# EAGLE design diyAutoSteer (EAGLE 7.6.0)
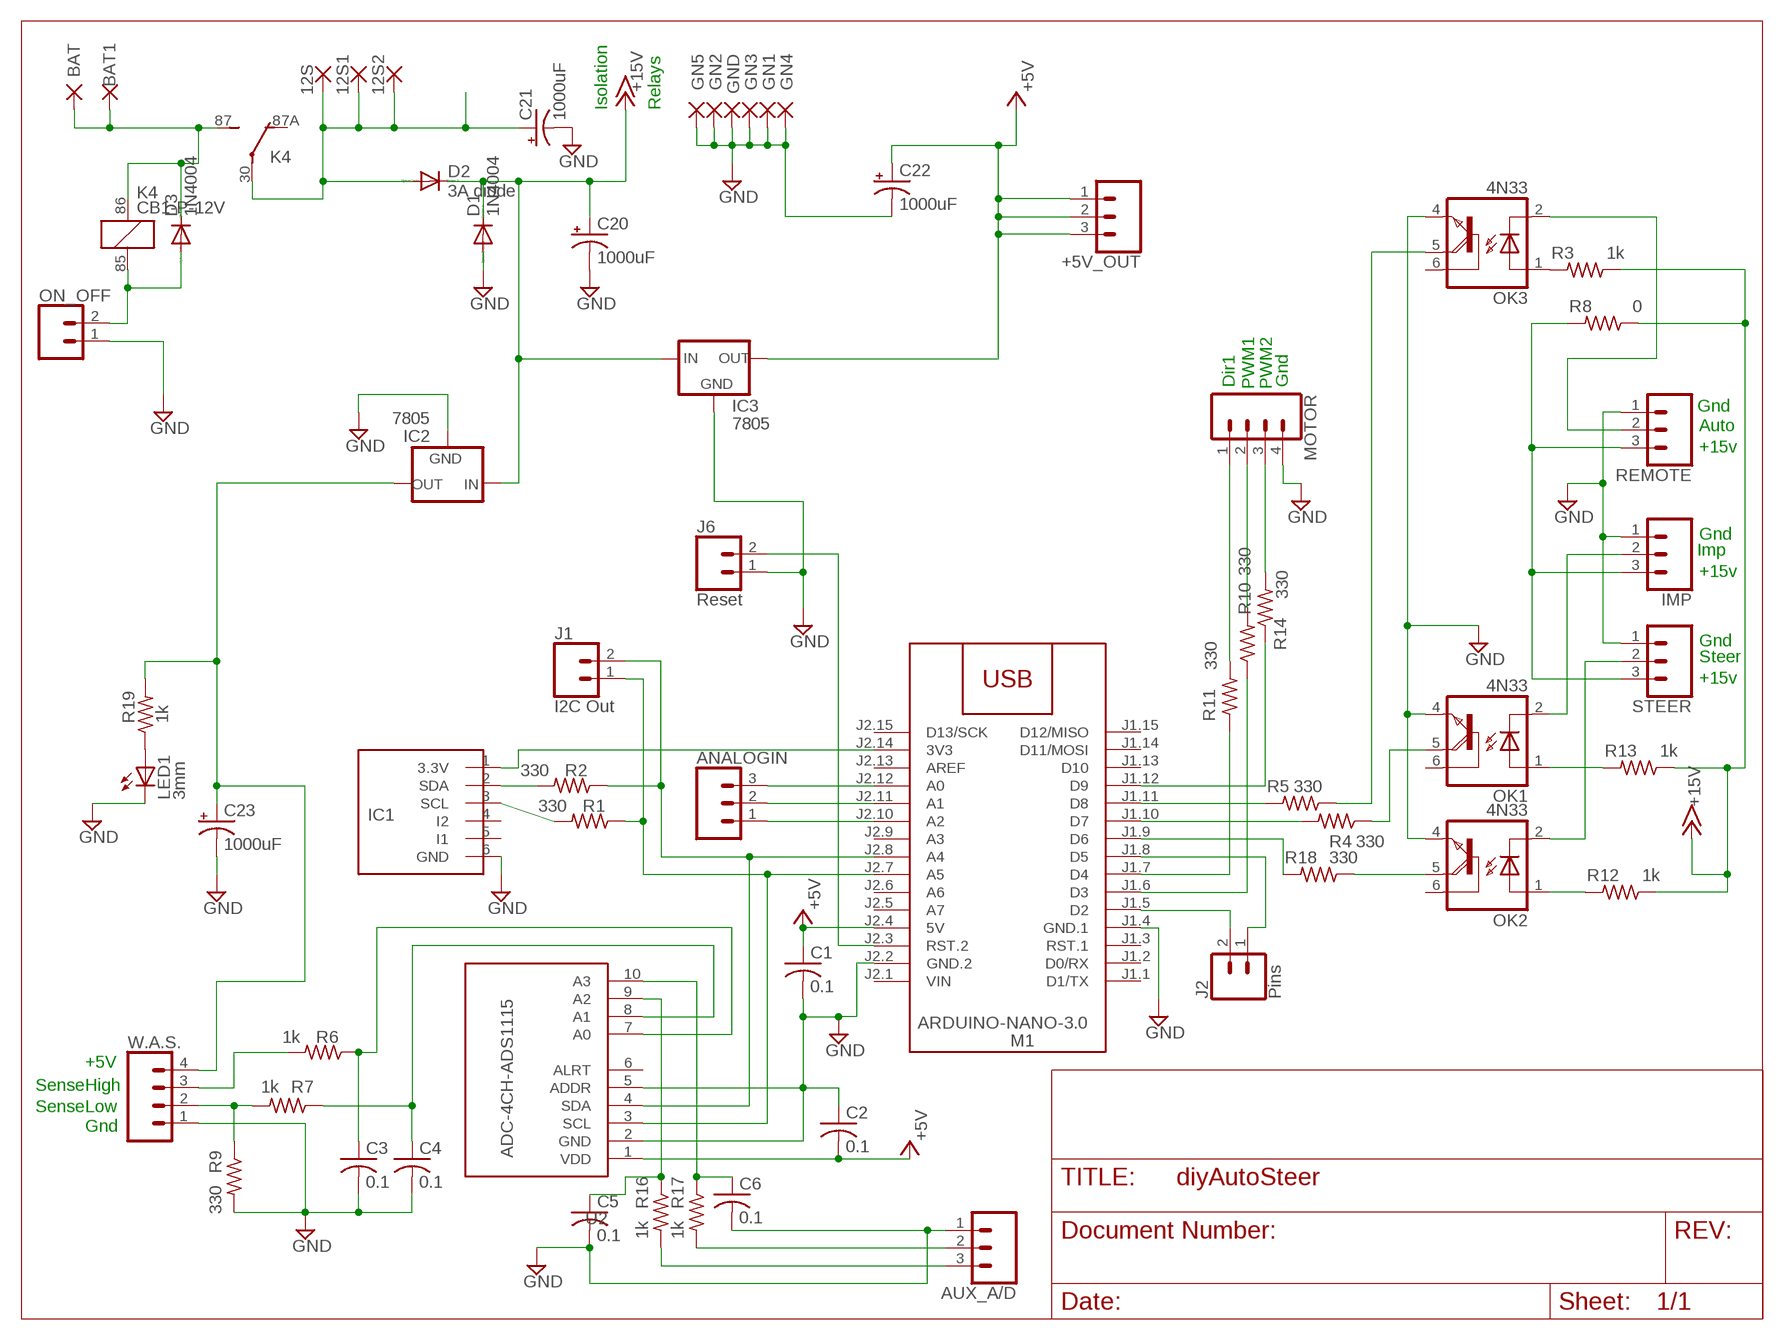
[diagram p0: schematic, sheet 1]

## Parts
12S  WIREPAD3,81/1,1  [3,81/1,1]
12S1  WIREPAD3,81/1,1  [3,81/1,1]
12S2  WIREPAD3,81/1,1  [3,81/1,1]
+5V_OUT  CONN_03LONGPADS  [1X03_LONGPADS]
ANALOGIN  CONN_03LONGPADS  [1X03_LONGPADS]
AUX_A/D  CONN_03LONGPADS  [1X03_LONGPADS]
BAT  WIREPAD3,81/1,1  [3,81/1,1]
BAT1  WIREPAD3,81/1,1  [3,81/1,1]
C1  0.1  C-US025-025X050  [C025-025X050]
C2  0.1  C-US025-025X050  [C025-025X050]
C3  0.1  C-US025-025X050  [C025-025X050]
C4  0.1  C-US025-025X050  [C025-025X050]
C5  0.1  C-US025-025X050  [C025-025X050]
C6  0.1  C-US025-025X050  [C025-025X050]
C20  1000uF  CPOL-USE5-10.5  [E5-10,5]
C21  1000uF  CPOL-USE5-10.5  [E5-10,5]
C22  1000uF  CPOL-USE5-10.5  [E5-10,5]
C23  1000uF  CPOL-USE5-10.5  [E5-10,5]
D1  1N4004  [DO41-10]
D2  3A diode  DIODE-DO27-15  [DO27-15]
D3  1N4004  [DO41-10]
GN1  WIREPAD3,81/1,1  [3,81/1,1]
GN2  WIREPAD3,81/1,1  [3,81/1,1]
GN3  WIREPAD3,81/1,1  [3,81/1,1]
GN4  WIREPAD3,81/1,1  [3,81/1,1]
GN5  WIREPAD3,81/1,1  [3,81/1,1]
GND  WIREPAD3,81/1,1  [3,81/1,1]
IC1  MMA8452Q  [BREAKOUT_6PIN]
IC2  7805  78XXS  [78XXS]
IC3  7805  78XXS  [78XXS]
IMP  CONN_03LONGPADS  [1X03_LONGPADS]
J1  I2C Out  CONN_02PTH3  [1X02_LONGPADS]
J2  Pins  CONN_02PTH3  [1X02_LONGPADS]
J6  Reset  CONN_02PTH3  [1X02_LONGPADS]
K4  CB1-P-12V  [CB1]
LED1  3mm  LED3MM  [LED3MM]
M1  ARDUINO-NANO-3.0  [ARDUINO-NANO-3.0]
MOTOR  CONN_04LONGPADS  [1X04_LONGPADS]
OK1  4N33  [DIL06]
OK2  4N33  [DIL06]
OK3  4N33  [DIL06]
ON_OFF  CONN_02PTH3  [1X02_LONGPADS]
R1  330  R-US_0309/12  [0309/12]
R2  330  R-US_0309/12  [0309/12]
R3  1k  R-US_0309/12  [0309/12]
R4  330  R-US_0309/12  [0309/12]
R5  330  R-US_0309/12  [0309/12]
R6  1k  R-US_0309/12  [0309/12]
R7  1k  R-US_0309/12  [0309/12]
R8  0  R-US_0309/12  [0309/12]
R9  330  R-US_0309/12  [0309/12]
R10  330  R-US_0309/12  [0309/12]
R11  330  R-US_0309/12  [0309/12]
R12  1k  R-US_0309/12  [0309/12]
R13  1k  R-US_0309/12  [0309/12]
R14  330  R-US_0309/12  [0309/12]
R16  1k  R-US_0309/12  [0309/12]
R17  1k  R-US_0309/12  [0309/12]
R18  330  R-US_0309/12  [0309/12]
R19  1k  R-US_0309/12  [0309/12]
REMOTE  CONN_03LONGPADS  [1X03_LONGPADS]
STEER  CONN_03LONGPADS  [1X03_LONGPADS]
U2  ADC-4CH-ADS1115  [ADC-4CH-ADS1115]
W.A.S.  CONN_04LONGPADS  [1X04_LONGPADS]

## Nets
+5V: +5V_OUT.1 +5V_OUT.2 +5V_OUT.3 C1.1 C2.2 C22.+ IC3.OUT M1.J2.4(5V) U2.1(VDD)
+15V: C20.+ D1.C D2.C IC2.IN IC3.IN R3.1 R8.1 R12.1 R13.1
BATT: BAT1.1(P) BAT.1(P) D3.C K4.86 K4.87(2:S)
GND: AUX_A/D.1 C1.2 C2.1 C3.2 C4.2 C5.2 C6.2 C20.- C21.- C22.- C23.- D1.A GN1.1(P) GN2.1(P) GN3.1(P) GN4.1(P) GN5.1(P) GND.1(P) IC1.6(GND) IC2.GND IC3.GND IMP.1 J6.1 LED1.K(C) M1.J1.4(GND.1) M1.J2.2(GND.2) MOTOR.4 OK1.4(E) OK2.4(E) OK3.4(E) ON_OFF.1 R9.2 REMOTE.1 STEER.1 U2.2(GND) U2.5(ADDR) W.A.S..1
N$1: IC1.1(3.3V) M1.J2.14(3V3)
N$2: R7.2 R9.1 W.A.S..2
N$3: IMP.3 R8.2 REMOTE.3 STEER.3
N$4: M1.J1.6(D3) R10.1
N$5: M1.J1.7(D4) R11.1
N$6: J2.2 M1.J1.5(D2)
N$7: J6.2 M1.J2.3(RST.2)
N$8: R6.2 W.A.S..3
N$10: ANALOGIN.3 M1.J2.12(A0)
N$11: M1.J1.12(D9) R14.1
N$12: IC1.2(SDA) R2.2
N$13: IC1.3(SCL) R1.2
N$14: ANALOGIN.2 M1.J2.11(A1)
N$15: ANALOGIN.1 M1.J2.10(A2)
N$16: LED1.A R19.1
N$17: MOTOR.2 R10.2
N$18: J2.1 M1.J1.8(D5)
N$19: MOTOR.1 R11.2
N$20: C3.1 R6.1 U2.7(A0)
N$21: MOTOR.3 R14.2
N$22: OK2.2(C) STEER.2
N$23: M1.J1.11(D8) R5.2
N$24: D3.A K4.85 ON_OFF.2
N$25: OK2.1(A) R12.2
N$26: OK3.1(A) R3.2
N$27: M1.J1.10(D7) R4.2
N$28: OK3.2(C) REMOTE.2
N$29: IMP.2 OK1.2(C)
N$31: M1.J1.9(D6) R18.2
N$32: OK1.1(A) R13.2
N$34: OK3.5(COL) R5.1
N$35: C6.1 R17.1 U2.10(A3)
N$36: C5.1 R16.1 U2.9(A2)
N$37: OK1.5(COL) R4.1
N$38: AUX_A/D.2 R17.2
N$39: OK2.5(COL) R18.1
N$44: C4.1 R7.1 U2.8(A1)
N$47: AUX_A/D.3 R16.2
SCL: J1.1 M1.J2.7(A5) R1.1 U2.3(SCL)
SDA: J1.2 M1.J2.8(A4) R2.1 U2.4(SDA)
SW_RAW: 12S1.1(P) 12S2.1(P) 12S.1(P) C21.+ D2.A K4.30(2:P)
V+WAS: C23.+ IC2.OUT R19.2 W.A.S..4
Unconnected: IC1.4(I2) IC1.5(I1) K4.87A(2:O) M1.J1.1(D1/TX) M1.J1.2(D0/RX) M1.J1.3(RST.1) M1.J1.13(D10) M1.J1.14(D11/MOSI) M1.J1.15(D12/MISO) M1.J2.5(A7) M1.J2.6(A6) M1.J2.9(A3) M1.J2.13(AREF) M1.J2.15(D13/SCK) OK1.6(B) OK2.6(B) OK3.6(B) U2.6(ALRT)

## Notes on the sheet
- Isolation | Relays
- Dir1 | PWM1 | PWM2 | Gnd
- Gnd
- Auto
- +15v
- Gnd
- Imp
- +15v
- Gnd
- Steer
- +15v
- +5V
- Sense | High
- Sense | Low
- Gnd

## Power pins joined to a net without a drawn wire
VIN: M1.J2.1(VIN)

## Library data of the parts
12S 12S1 12S2 BAT BAT1 GN1-GN5 GND = wirepad:WIREPAD: Wire PAD connect wire on PCB
+5V_OUT ANALOGIN AUX_A/D IMP REMOTE STEER = SparkFun-Connectors:CONN_03: Multi connection point. Often used as Generic Header-pin footprint for 0.1 inch spaced/style header connections On any of the 0.1 inch spaced packages, you can populate with these: Break Away Headers - Straight <https://www.sparkfun.com/products/116> (PRT-00116) Break Away Male Headers - Right Angle <https://www.sparkfun.com/products/553> (PRT-00553) Female Headers <https://www.sparkfun.com/products/115> (PRT-00115) Break Away Headers - Machine Pin <https://www.sparkfun.com/products/117> (PRT-00117) Break Away Female Headers - Swiss Machine Pin <https://www.sparkfun.com/products/743> (PRT-00743) Stackable Header - 3 Pin (Female, 0.1") <https://www.sparkfun.com/products/13875> (PRT-13875) For SCREWTERMINALS and SPRING TERMINALS visit here: Screw Terimnals on SparkFun.com <https://www.sparkfun.com/search/results?term=Screw+Terminals> (5mm/3.5mm/2.54mm spacing) This device is also useful as a general connection point to wire up your design to another part of your project. Our various solder wires solder well into these plated through hole pads. Hook-Up Wire - Assortment (Stranded, 22 AWG) <https://www.sparkfun.com/products/11375> (PRT-11375) Hook-Up Wire - Assortment (Solid Core, 22 AWG) <https://www.sparkfun.com/products/11367> (PRT-11367) View the entire wire category on our website here <https://www.sparkfun.com/categories/141> Special notes: Molex polarized connector foot print use with SKU : PRT-08232 with associated crimp pins and housings.
C1-C6 = rcl:C-US: CAPACITOR, American symbol
C20-C23 = rcl:CPOL-US: POLARIZED CAPACITOR, American symbol
D1 D3 = diode:1N4004: DIODE general purpose rectifier, 1 A
D2 = diode:DIODE-: DIODE
IC1 = MMA8452Q:MMA8452Q
IC2 IC3 = v-reg:78XXS: VOLTAGE REGULATOR
J1 J2 J6 ON_OFF = SparkFun-Connectors:CONN_02: Multi connection point. Often used as Generic Header-pin footprint for 0.1 inch spaced/style header connections On any of the 0.1 inch spaced packages, you can populate with these: Break Away Headers - Straight <https://www.sparkfun.com/products/116> (PRT-00116) Break Away Male Headers - Right Angle <https://www.sparkfun.com/products/553> (PRT-00553) Female Headers <https://www.sparkfun.com/products/115> (PRT-00115) Break Away Headers - Machine Pin <https://www.sparkfun.com/products/117> (PRT-00117) Break Away Female Headers - Swiss Machine Pin <https://www.sparkfun.com/products/743> (PRT-00743) For SCREWTERMINALS and SPRING TERMINALS visit here: Screw Terimnals on SparkFun.com <https://www.sparkfun.com/search/results?term=Screw+Terminals> (5mm/3.5mm/2.54mm spacing) This device is also useful as a general connection point to wire up your design to another part of your project. Our various solder wires solder well into these plated through hole pads. Hook-Up Wire - Assortment (Stranded, 22 AWG) <https://www.sparkfun.com/products/11375> (PRT-11375) Hook-Up Wire - Assortment (Solid Core, 22 AWG) <https://www.sparkfun.com/products/11367> (PRT-11367) View the entire wire category on our website here <https://www.sparkfun.com/categories/141> Special notes: Molex polarized connector foot print use with: PRT-08233 with associated crimp pins and housings. 2.54_SCREWTERM for use with PRT-10571. 3.5mm Screw Terminal footprints for PRT-08084 5mm Screw Terminal footprints for use with PRT-08432
K4 = relay:CB1*: HIGH POWER AUTOMOTIVE RELAY Form C NAiS Source: http://www.mew-europe.com/.. en_ds_61202_0000.pdf; MF: AROMAT/ MATSUSHITA; MPN: CB1-P-12V; OC_FARNELL: unknown; OC_NEWARK: 52F9201
LED1 = led:LED: LED OSRAM: - CHIPLED LG R971, LG N971, LY N971, LG Q971, LY Q971, LO R971, LY R971 LH N974, LH R974 LS Q976, LO Q976, LY Q976 LO Q996 - Hyper CHIPLED LW Q18S LB Q993, LB Q99A, LB R99A - SideLED LS A670, LO A670, LY A670, LG A670, LP A670 LB A673, LV A673, LT A673, LW A673 LH A674 LY A675 LS A676, LA A676, LO A676, LY A676, LW A676 LS A679, LY A679, LG A679 - Hyper Micro SIDELED® LS Y876, LA Y876, LO Y876, LY Y876 LT Y87S - SmartLED LW L88C, LW L88S LB L89C, LB L89S, LG L890 LS L89K, LO L89K, LY L89K LS L896, LA L896, LO L896, LY L896 - TOPLED LS T670, LO T670, LY T670, LG T670, LP T670 LSG T670, LSP T670, LSY T670, LOP T670, LYG T670 LG T671, LOG T671, LSG T671 LB T673, LV T673, LT T673, LW T673 LH T674 LS T676, LA T676, LO T676, LY T676, LB T676, LH T676, LSB T676, LW T676 LB T67C, LV T67C, LT T67C, LS T67K, LO T67K, LY T67K, LW E67C LS E67B, LA E67B, LO E67B, LY E67B, LB E67C, LV E67C, LT E67C LW T67C LS T679, LY T679, LG T679 LS T770, LO T770, LY T770, LG T770, LP T770 LB T773, LV T773, LT T773, LW T773 LH T774 LS E675, LA E675, LY E675, LS T675 LS T776, LA T776, LO T776, LY T776, LB T776 LHGB T686 LT T68C, LB T68C - Hyper Mini TOPLED® LB M676 - Mini TOPLED Santana® LG M470 LS M47K, LO M47K, LY M47K Source: http://www.osram.convergy.de LUXEON: - LUMILED® LXK2-PW12-R00, LXK2-PW12-S00, LXK2-PW14-U00, LXK2-PW14-V00 LXK2-PM12-R00, LXK2-PM12-S00, LXK2-PM14-U00 LXK2-PE12-Q00, LXK2-PE12-R00, LXK2-PE12-S00, LXK2-PE14-T00, LXK2-PE14-U00 LXK2-PB12-K00, LXK2-PB12-L00, LXK2-PB12-M00, LXK2-PB14-N00, LXK2-PB14-P00, LXK2-PB14-Q00 LXK2-PR12-L00, LXK2-PR12-M00, LXK2-PR14-Q00, LXK2-PR14-R00 LXK2-PD12-Q00, LXK2-PD12-R00, LXK2-PD12-S00 LXK2-PH12-R00, LXK2-PH12-S00 LXK2-PL12-P00, LXK2-PL12-Q00, LXK2-PL12-R00 Source: www.luxeon.com KINGBRIGHT: KA-3528ASYC Source: www.kingbright.com
M1 = diy-modules:ARDUINO-NANO-3.0: Arduino Nano 3.0 and compatible devices More details available here: https://www.arduino.cc/en/Main/ArduinoBoardNano Click here to find device on ebay.com <http://www.ebay.com/sch/arduino+nano>
MOTOR W.A.S. = SparkFun-Connectors:CONN_04: Multi connection point. Often used as Generic Header-pin footprint for 0.1 inch spaced/style header connections On any of the 0.1 inch spaced packages, you can populate with these: Break Away Headers - Straight <https://www.sparkfun.com/products/116> (PRT-00116) Break Away Male Headers - Right Angle <https://www.sparkfun.com/products/553> (PRT-00553) Female Headers <https://www.sparkfun.com/products/115> (PRT-00115) Break Away Headers - Machine Pin <https://www.sparkfun.com/products/117> (PRT-00117) Break Away Female Headers - Swiss Machine Pin <https://www.sparkfun.com/products/743> (PRT-00743) For SCREWTERMINALS and SPRING TERMINALS visit here: Screw Terimnals on SparkFun.com <https://www.sparkfun.com/search/results?term=Screw+Terminals> (5mm/3.5mm/2.54mm spacing) This device is also useful as a general connection point to wire up your design to another part of your project. Our various solder wires solder well into these plated through hole pads. Hook-Up Wire - Assortment (Stranded, 22 AWG) <https://www.sparkfun.com/products/11375> (PRT-11375) Hook-Up Wire - Assortment (Solid Core, 22 AWG) <https://www.sparkfun.com/products/11367> (PRT-11367) View the entire wire category on our website here <https://www.sparkfun.com/categories/141> Special notes: Molex polarized connector foot print use with SKU : PRT-08231 with associated crimp pins and housings. 1MM SMD Version SKU: PRT-10208; PROD_ID: CONN-09696
OK1-OK3 = optocoupler:4N33: MOTOROLA OPTO COUPLER; MF: VISHAY/TELEFUNKEN; MPN: 4N33; OC_FARNELL: 1469601; OC_NEWARK: 88K1390
R1-R14 R16-R19 = rcl:R-US_: RESISTOR, American symbol
U2 = diy-modules:ADC-4CH-ADS1115: 4 Channel 16-Bit Analog-to-Digital Converter based on ADS1115 chip Arduino ADS1115 Getting Started Tutorial is available here: http://henrysbench.capnfatz.com/henrys-bench/arduino-voltage-measurements/arduino-ads1115-module-getting-started-tutorial/ ADS1115 datasheet is available here: http://www.ti.com/lit/ds/symlink/ads1115.pdf Click here to find device on ebay.com <http://www.ebay.com/sch/ads1115+module>

## Module MOTOR_CONTROLLER
Ports: 

### Library data of the parts

## Board
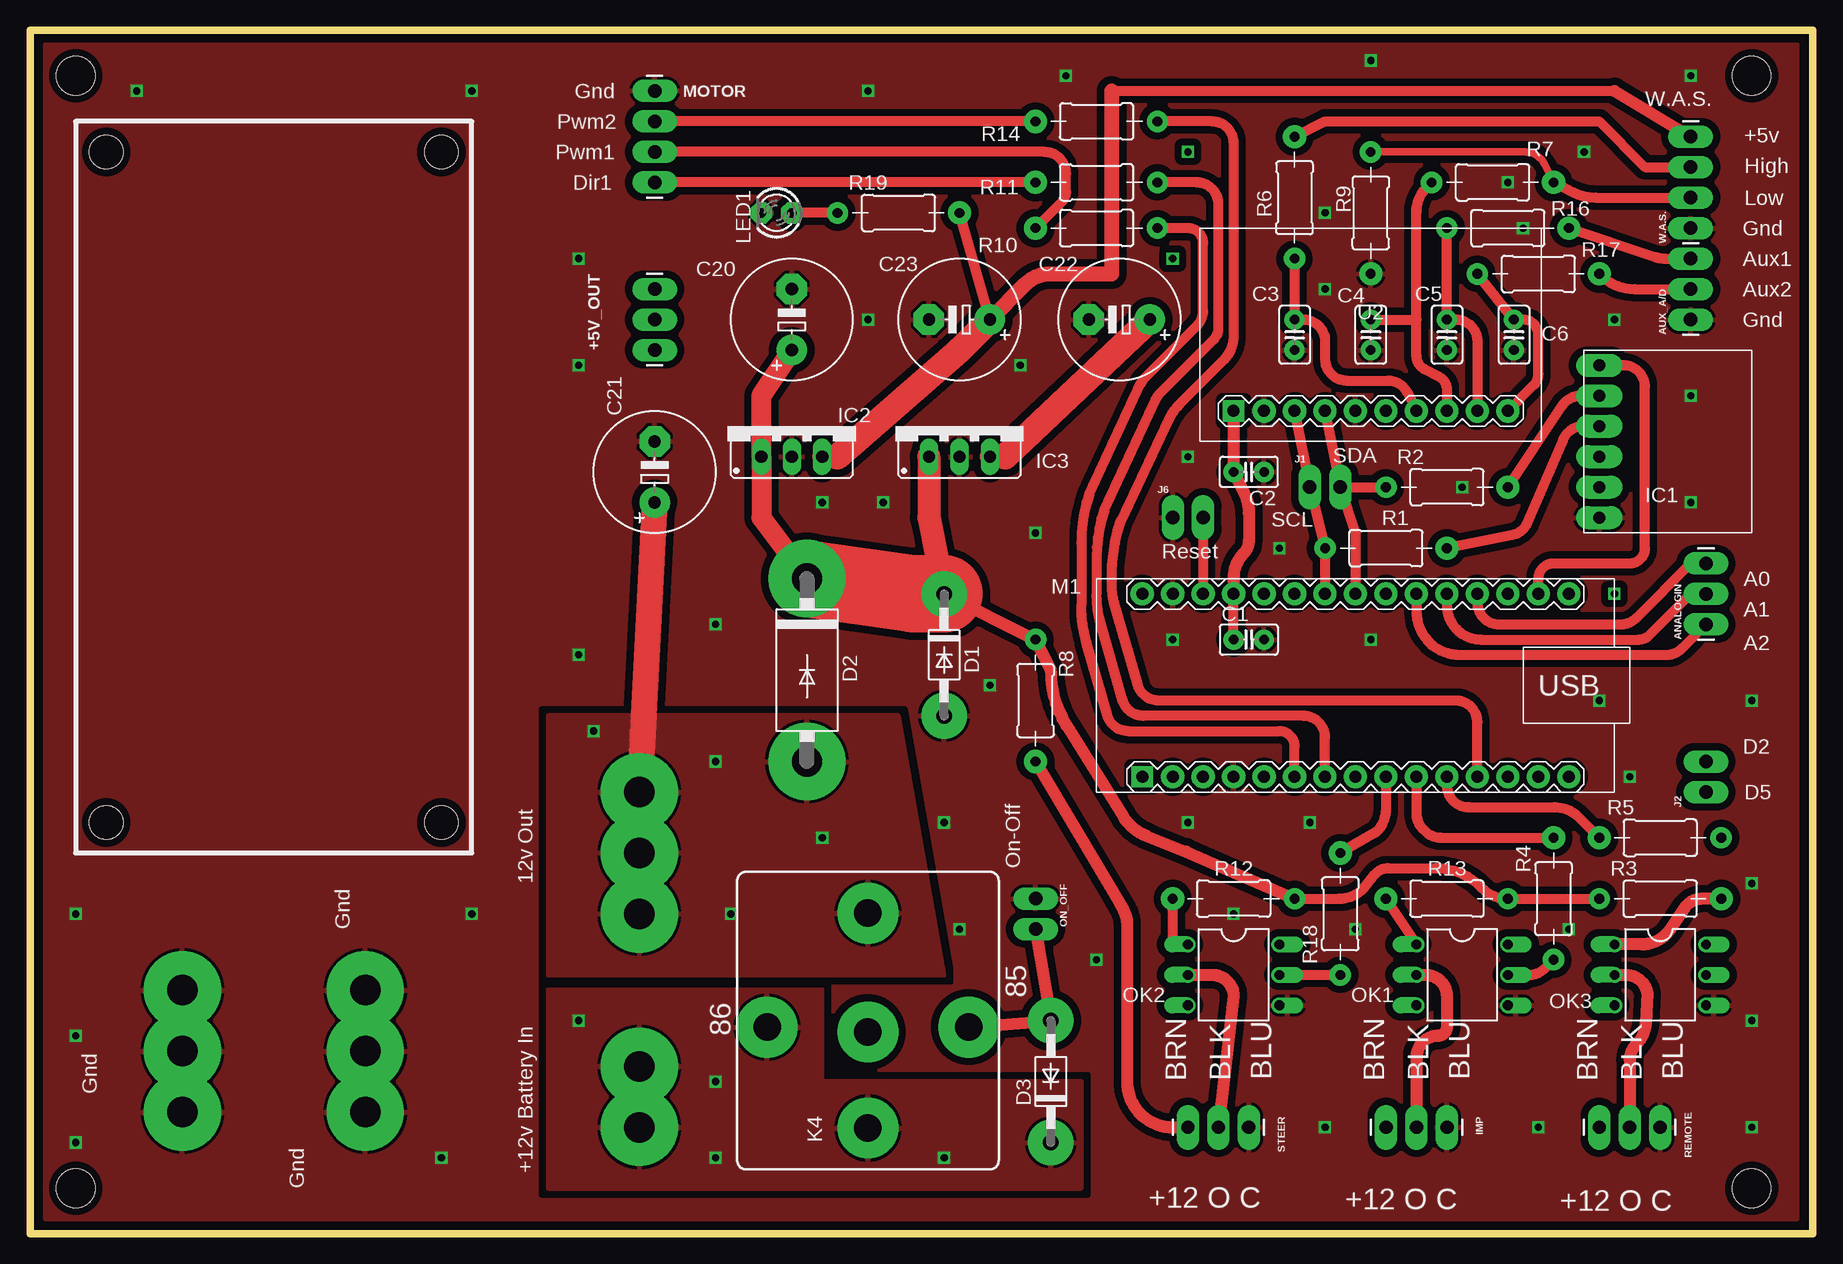
[diagram p1: board, top side]
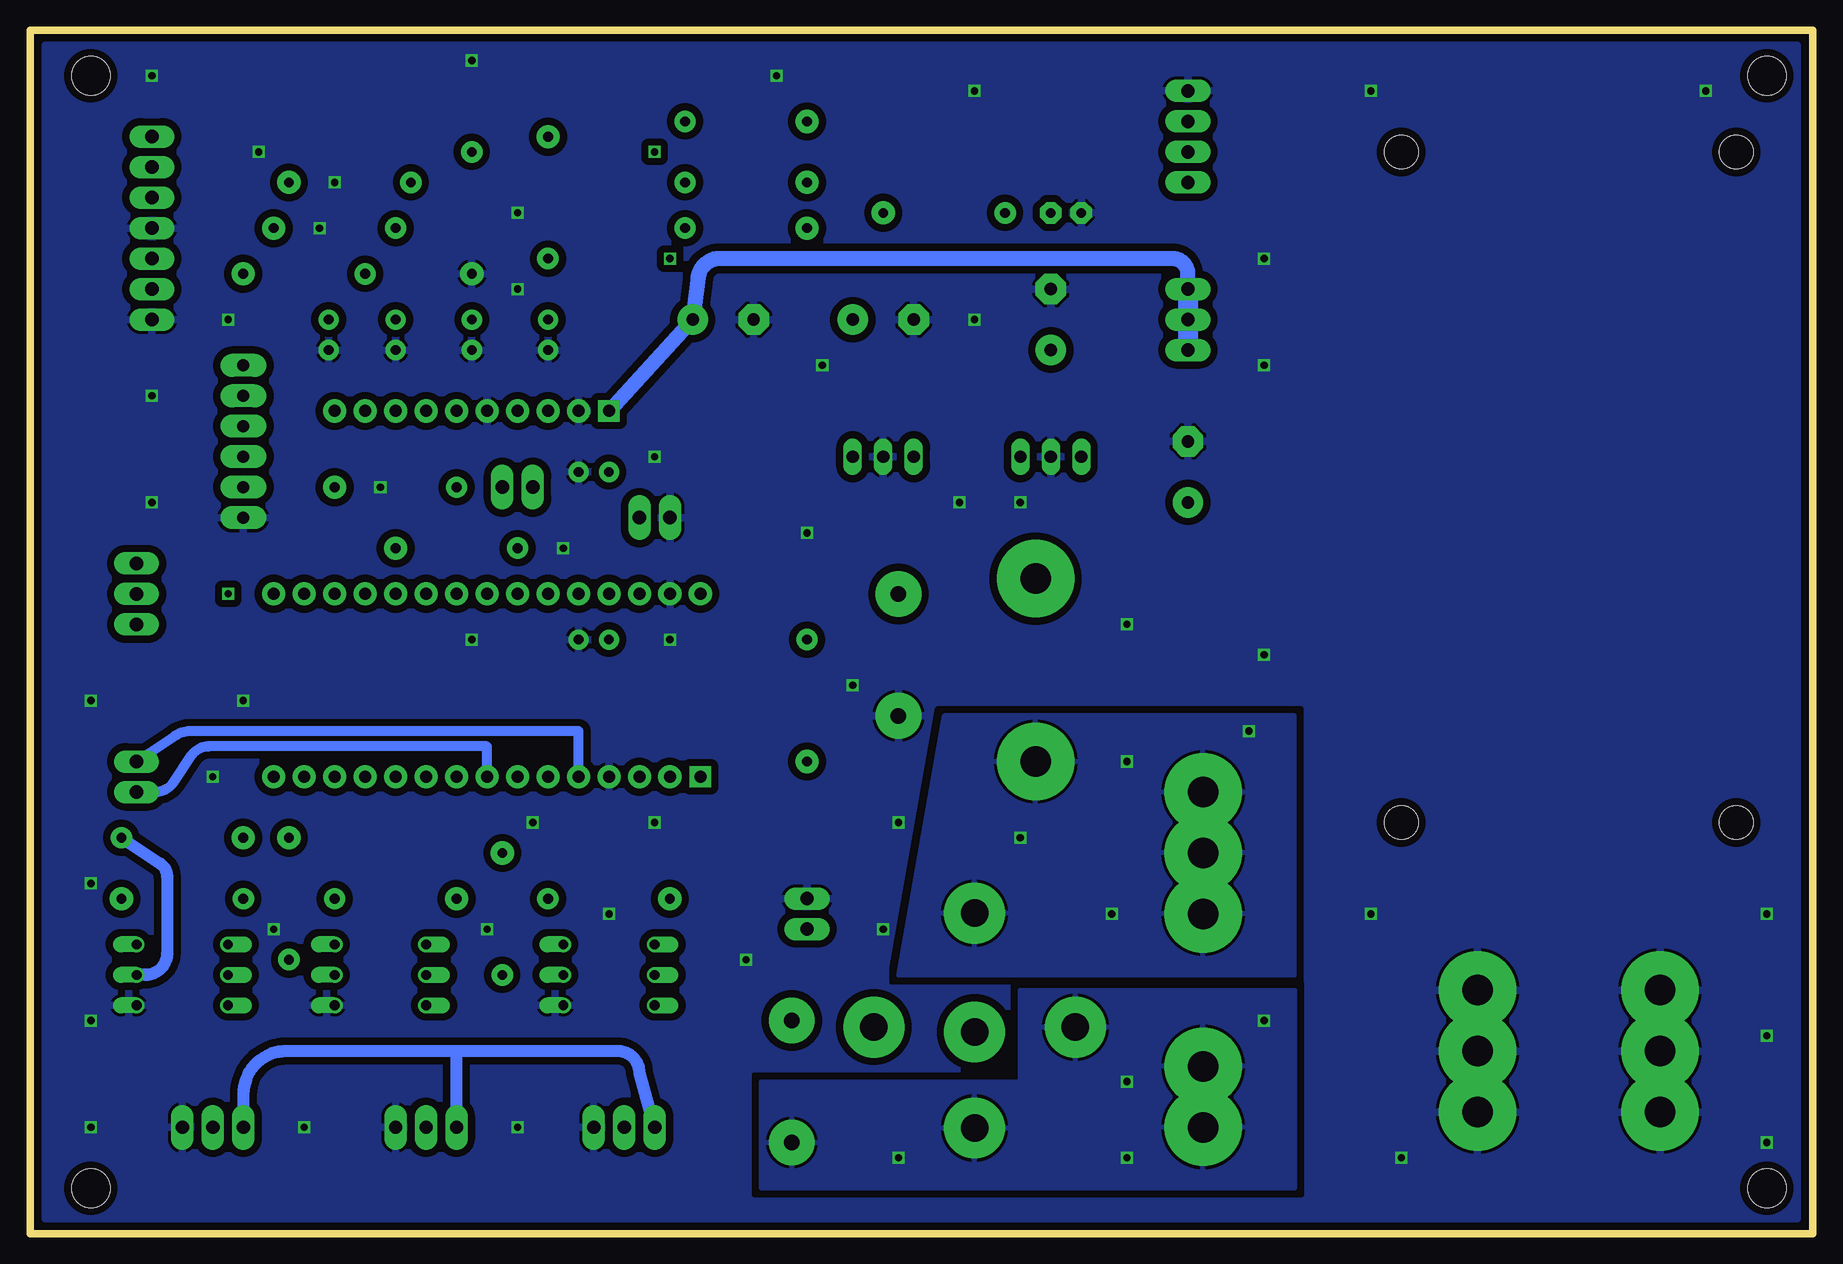
[diagram p2: board, bottom side, seen from below]

Size 148.59 x 100.33 mm. Coordinates in mm from the lower left corner, seen from the top.
Outline: 148.59,0 148.59,100.33 0,100.33 0,0 148.59,0
Copper layers (1*16): Top 0.035mm / dielectric 1.5mm / Bottom 0.035mm
Design rules "default *": minimum track width 16mil, minimum drill 0.35mm, track to track 6mil, track to pad 6mil, pad to pad 6mil, via to via 6mil, smd to smd 6mil, copper to edge 8mil, drill to drill 6mil, minimum pad ring 10mil, minimum via ring 8mil, stop-mask expansion 4mil, vias tented up to drill 0mil, thermal gap 10mil
Holes 3.2 mm at 143.51,3.81 143.51,96.52 3.81,3.81 3.81,96.52
Holes 2.8 mm at 6.35,90.17 34.29,90.17 34.29,34.29 6.35,34.29

### Footprints (pad centres in the part's own frame; a part is rotated, then mirrored left to right if it is on the bottom)
3,81/1,1 = drill 2.54 pad 6.452: 1 0,0
1X03_LONGPADS = drill 1.118 pad 1.88 long: 1 0,0; 2 2.54,0; 3 5.08,0
C025-025X050 = drill 0.813 pad 1.676: 1 -1.27,0; 2 1.27,0
E5-10,5 = drill 1.016 pad 2.54: + -2.54,0 | drill 1.016 pad 2.54 octagon: - 2.54,0
DO41-10 = drill 1.3 pad 3.81: A 5.08,0; C -5.08,0
DO27-15 = drill 2.54 pad 6.452: A 7.62,0; C -7.62,0
BREAKOUT_6PIN = drill 1 pad 1.93 long: 1 0,6.35; 2 0,3.81; 3 0,1.27; 4 0,-1.27; 5 0,-3.81; 6 0,-6.35
78XXS = drill 1.016 long: GND 0,-2.54; IN -2.54,-2.54; OUT 2.54,-2.54
1X02_LONGPADS = drill 1.118 pad 1.88 long: 1 0,0; 2 2.54,0
CB1 = drill 2.3 pad 5.08: 30 8.95,0; 85 -0.55,-8.4; 86 -0.55,8.4; 87 -8.95,0; 87A -0.95,0
LED3MM = drill 0.813 pad 1.778 octagon: A -1.27,0; K 1.27,0
ARDUINO-NANO-3.0 = drill 1 pad 1.778 square: J1.1 17.78,7.62 | drill 1 pad 1.93: J1.2 15.24,7.62; J1.3 12.7,7.62; J1.4 10.16,7.62; J1.5 7.62,7.62; J1.6 5.08,7.62; J1.7 2.54,7.62; J1.8 0,7.62; J1.9 -2.54,7.62; J1.10 -5.08,7.62; J1.11 -7.62,7.62; J1.12 -10.16,7.62; J1.13 -12.7,7.62; J1.14 -15.24,7.62; J1.15 -17.78,7.62; J2.1 17.78,-7.62; J2.2 15.24,-7.62; J2.3 12.7,-7.62; J2.4 10.16,-7.62; J2.5 7.62,-7.62; J2.6 5.08,-7.62; J2.7 2.54,-7.62; J2.8 0,-7.62; J2.9 -2.54,-7.62; J2.10 -5.08,-7.62; J2.11 -7.62,-7.62; J2.12 -10.16,-7.62; J2.13 -12.7,-7.62; J2.14 -15.24,-7.62; J2.15 -17.78,-7.62
1X04_LONGPADS = drill 1.118 pad 1.88 long: 1 0,0; 2 2.54,0; 3 5.08,0; 4 7.62,0
DIL06 = drill 0.813 offset: 1 -2.54,-3.81; 2 0,-3.81; 3 2.54,-3.81; 4 2.54,3.81; 5 0,3.81; 6 -2.54,3.81
0309/12 = drill 0.813 pad 1.778: 1 -5.08,0 | drill 0.813 pad 1.93: 2 5.08,0
ADC-4CH-ADS1115 = drill 1 pad 1.778 square: 1 -6.35,11.43 | drill 1 pad 1.93: 2 -6.35,8.89; 3 -6.35,6.35; 4 -6.35,3.81; 5 -6.35,1.27; 6 -6.35,-1.27; 7 -6.35,-3.81; 8 -6.35,-6.35; 9 -6.35,-8.89; 10 -6.35,-11.43

### Placement (x,y rotation side)
12S  50.8,31.75 0 top
12S1  50.8,36.83 180 top
12S2  50.8,26.67 270 top
+5V_OUT  52.07,73.66 90 top
ANALOGIN  139.7,50.8 90 top
AUX_A/D  138.43,76.2 90 top
BAT  50.8,13.97 180 top
BAT1  50.8,8.89 180 top
C1  101.6,49.53 0 top
C2  101.6,63.5 180 top
C3  105.41,74.93 270 top
C4  111.76,74.93 270 top
C5  118.11,74.93 270 top
C6  123.7,74.93 270 top
C20  63.5,76.2 90 top
C21  52.07,63.5 90 top
C22  90.81,76.2 180 top
C23  77.47,76.2 180 top
D1  76.2,48.26 270 top
D2  64.77,46.99 270 top
D3  85.09,12.7 90 top
GN1  12.7,15.24 0 top
GN2  27.94,15.24 180 top
GN3  27.94,10.16 0 top
GN4  12.7,10.16 0 top
GN5  12.7,20.32 180 top
GND  27.94,20.32 180 top
IC1  130.81,66.04 0 top
IC2  63.5,67.31 0 top
IC3  77.47,67.31 0 top
IMP  118.11,8.89 180 top
J1  106.68,62.23 0 top
J2  139.7,36.83 90 top
J6  95.25,59.69 0 top
K4  69.85,17.78 90 top
LED1  62.23,85.09 180 top
M1  110.49,45.72 180 top
MOTOR  52.07,87.63 90 top
OK1  119.38,21.59 270 top
OK2  100.33,21.59 270 top
OK3  135.89,21.59 270 top
ON_OFF  83.82,27.94 270 top
R1  113.03,57.15 0 top
R2  118.11,62.23 0 top
R3  135.89,27.94 0 top
R4  127,27.94 90 top
R5  135.89,33.02 180 top
R6  105.41,86.36 90 top
R7  121.92,87.63 0 top
R8  83.82,44.45 270 top
R9  111.76,85.09 270 top
R10  88.9,83.82 180 top
R11  88.9,87.63 180 top
R12  100.33,27.94 180 top
R13  118.11,27.94 180 top
R14  88.9,92.71 180 top
R16  123.19,83.82 0 top
R17  125.73,80.01 0 top
R18  109.22,26.67 90 top
R19  72.39,85.09 0 top
REMOTE  135.89,8.89 180 top
STEER  101.6,8.89 180 top
U2  111.76,74.93 90 top
W.A.S.  138.43,83.82 90 top

### Tracks (layer width: path | path; a pad name or v marks a point on that pad's centre or on a via)
+5V
  Top 0.813: C1.1 M1.J2.4
  Top 1.016: U2.1 C2.2 101.2,61.76 arc-27 101.6,60.06 101.6,57.77 arc-45 101.16,56.71 arc45 100.33,54.7 M1.J2.4
  Top 1.676: IC3.OUT 81.28,64.77
  Top 2.184: C22.+ 81.28,64.77
  Bottom 1.27: +5V_OUT.3 52.07,80.01 arc-90 53.34,81.28 91.12,81.28 arc-83 92.91,79.71 C22.+ U2.1
  Bottom 1.676: +5V_OUT.1 +5V_OUT.2 +5V_OUT.3
+15V
  Top 0.813: R12.1 109.12,27.94 arc51 111.34,29.01 112.11,29.97 arc-51 113.18,30.48 117.21,30.48 arc-45 120.91,28.95 121.09,28.77 arc45 123.1,27.94 R13.1 R3.1
  Top 1.016: D1.C R8.1 85.09,46.89 arc32 86.39,42.38 91.15,34.75 arc36 93.03,33.19 96.36,31.87 R12.1
  Top 1.676: C20.+ 60.96,69.85 IC2.IN 60.96,59.69 D2.C
  Top 1.93: IC3.IN 74.93,59.69 D1.C
  Top 6.452: D2.C 73.66,53.34 D1.C
BATT  (via drill 0.6)
  other vias: 45.72,17.78 57.15,12.7 76.2,6.35 57.15,6.35
  pour Bottom (isolate 0.61): 43.18,20.32 43.18,3.81 87.63,3.81 87.63,12.7 66.04,12.7 66.04,20.32
  pour Top (isolate 0.61): 43.18,20.32 43.18,3.81 87.63,3.81 87.63,12.7 66.04,12.7 66.04,20.32
GND  (via drill 0.6)
  other vias: 3.81,26.67 3.81,16.51 3.81,7.62 34.29,6.35 36.83,26.67 45.72,48.26 57.15,50.8 45.72,72.39 45.72,81.28 36.83,95.25 8.89,95.25 69.85,95.25 86.36,96.52 111.76,97.79 138.43,96.52 129.54,90.17 132.08,76.2 124.46,83.82 123.19,87.63 107.95,85.09 107.95,78.74 96.52,64.77 104.14,57.15 119.38,62.23 138.43,69.85 138.43,60.96 111.76,49.53 95.25,49.53 83.82,58.42 71.12,60.96 66.04,60.96 80.01,45.72 76.2,34.29 130.81,44.45 143.51,44.45 133.35,38.1 143.51,29.21 143.51,17.78 143.51,8.89 125.73,8.89 107.95,8.89 88.9,22.86 77.47,25.4 96.52,34.29 106.68,34.29 110.49,25.4 100.33,26.67 128.27,25.4 69.85,76.2 82.55,72.39
  pour Bottom (isolate 0.61, rank 2): 1.27,99.06 147.32,99.06 147.32,1.27 1.27,1.27
  pour Top (isolate 0.61, rank 2): 1.27,99.06 1.27,1.27 147.32,1.27 147.32,99.06
N$1
  Top 0.813: M1.J2.14 125.73,54.61 arc-90 127,55.88 133.35,55.88 arc90 134.62,57.15 134.62,70.59 arc90 132.82,72.39 IC1.1
N$2
  Top 0.61: R9.1 124.62,90.17 arc-63 126.23,89.18 R7.2
  Top 0.813: R7.2 128.69,86.78 arc27 130.49,86.36 W.A.S..2
N$3
  Top 1.016: R8.2 90.93,27.4 arc-35 91.44,25.77 91.44,12.7 arc90 95.25,8.89 STEER.3
  Bottom 1.016: STEER.3 97.79,13.44 arc-90 99.59,15.24 113.03,15.24 | IMP.3 113.03,15.24 | 113.03,15.24 127.22,15.24 arc-90 130.81,11.65 REMOTE.3
N$4
  Top 0.813: M1.J1.6 105.41,40.64 arc90 104.14,41.91 91.53,41.91 arc-74 89.8,43.21 88.07,49.27 arc-16 87.63,52.39 87.63,57.57 arc-18 88.3,61.7 92.58,70.83 arc-20 92.93,71.34 97.26,75.67 arc45 97.79,76.94 97.79,82.55 arc90 96.52,83.82 R10.1
N$5
  Top 0.813: M1.J1.7 107.95,41.38 arc90 106.15,43.18 92.8,43.18 arc-74 91.07,44.48 89.26,50.83 arc-16 88.9,53.37 88.9,56.39 arc-18 89.54,60.35 93.85,69.56 arc-20 94.2,70.07 98.69,74.56 arc45 99.06,75.46 99.06,85.83 arc90 97.26,87.63 R11.1
N$6
  Bottom 0.813: M1.J1.5 102.87,41.91 135.12,41.91 arc-34 136.53,41.48 J2.2
N$7
  Top 0.813: J6.2 M1.J2.3
N$8
  Top 0.813: R6.2 107.95,92.71 130.81,92.71 134.62,88.9 W.A.S..3
N$10
  Top 0.813: M1.J2.12 120.65,52.6 arc90 122.45,50.8 132.61,50.8 arc45 133.88,51.33 138.43,55.88 ANALOGIN.3
N$11
  Top 0.813: M1.J1.12 120.65,42.65 arc90 118.85,44.45 94.06,44.45 arc-74 92.34,45.75 90.37,52.63 arc-16 90.17,54.07 90.17,54.74 arc-18 90.93,59.44 94.91,67.86 arc-20 95.81,69.14 99.5,72.83 arc45 100.33,74.84 100.33,90.91 arc90 98.53,92.71 R14.1
N$12
  Top 0.813: R2.2 127.74,69.05 arc-56 129.23,69.85 IC1.2
N$13
  Top 0.813: IC1.3 129.45,67.31 arc67 127.8,66.22 124.83,59.29 arc-55 123.53,58.23 R1.2
N$14
  Top 0.813: M1.J2.11 118.11,52.37 arc90 120.95,49.53 134.09,49.53 arc45 134.99,49.9 138.43,53.34 ANALOGIN.2
N$15
  Top 0.813: M1.J2.10 115.57,51.85 arc90 119.16,48.26 136.42,48.26 arc45 137.69,48.79 ANALOGIN.1
N$16
  Top 0.813: R19.1 LED1.A
N$17
  Top 0.813: R10.2 85.99,85.99 arc45 86.36,86.89 86.36,88.37 arc90 84.56,90.17 MOTOR.2
N$18
  Bottom 0.813: M1.J1.8 110.49,40.64 133.66,40.64 arc-56 135.15,39.84 136.63,37.63 arc56 138.12,36.83 J2.1
N$19
  Top 0.813: R11.2 MOTOR.1
N$20
  Top 0.813: R6.1 C3.1 106.15,76.2 arc-90 107.95,74.4 107.95,72.92 arc90 109.75,71.12 113.19,71.12 arc-63 114.8,70.13 U2.7
N$21
  Top 0.813: R14.2 MOTOR.3
N$22
  Top 1.016: OK2.2 98.53,21.59 arc-90 100.33,19.79 STEER.2
N$23
  Top 0.813: M1.J1.11 118.11,37.36 arc90 119.91,35.56 127.09,35.56 arc-45 129.1,34.73 R5.2
N$24
  Top 1.016: ON_OFF.2 D3.A K4.85
N$25
  Top 0.813: OK2.1 95.25,24.13 R12.2
N$26
  Top 1.016: R3.2 139.39,27.94 arc56 137.9,27.14 136.73,25.39 arc-56 134.37,24.13 OK3.1
N$27
  Top 0.813: M1.J1.10 115.57,35.03 arc45 116.1,33.76 116.31,33.55 arc45 117.58,33.02 R4.2
N$28
  Top 1.016: OK3.2 133.03,21.59 arc-83 134.82,20.02 134.68,17.59 arc-42 133.85,15.74 arc45 133.35,14.53 REMOTE.2
N$29
  Top 1.016: OK1.2 116.31,21.59 arc-90 118.11,19.79 118.11,17.25 arc-90 117.37,16.51 arc90 115.57,14.71 IMP.2
N$31
  Top 0.813: M1.J1.9 113.03,35.47 arc-45 112.2,33.46 R18.2
N$32
  Top 0.813: R13.2 OK1.1
N$34
  Bottom 1.016: R5.1 137.73,30.86 arc56 137.16,29.8 137.16,23.39 arc90 138.96,21.59 OK3.5
N$35
  Top 0.813: U2.10 125.36,70.75 arc45 125.73,71.65 125.73,74.93 arc90 124.46,76.2 C6.1 R17.1
N$36
  Top 0.813: R16.1 C5.1 118.85,76.2 arc-90 120.65,74.4 U2.9
N$37
  Top 0.813: OK1.5 124.99,21.59 arc45 126.26,22.12 R4.1
N$38
  Top 0.813: R17.2 130.9,79.92 arc45 133.74,78.74 AUX_A/D.2
N$39
  Top 0.813: OK2.5 R18.1
N$44
  Top 0.813: U2.8 118.11,70.33 arc63 117.41,71.47 116.27,72.04 arc-63 115.57,73.17 115.57,76.2 | 115.57,76.2 115.57,85.18 arc-45 116.4,87.19 R7.1 | C4.1 115.57,76.2
N$47
  Top 0.813: R16.2 135.5,81.41 arc18 136.3,81.28 AUX_A/D.3
N$64  (via drill 0.6)
  other vias: 96.52,90.17
N$65  (via drill 0.6)
  other vias: 95.25,81.28
N$82  (via drill 0.6)
  other vias: 132.08,53.34
SCL
  Top 0.813: U2.3 J1.1 R1.1 M1.J2.7
SDA
  Top 0.813: U2.4 J1.2 | J1.2 110.49,58.42 M1.J2.8 | J1.2 R2.1
SW_RAW  (via drill 0.6)
  Top 2.184: C21.+ 12S1.1
  other vias: 46.99,41.91 57.15,39.37 58.42,26.67 66.04,33.02
  pour Bottom (isolate 0.61): 72.39,43.18 76.2,21.59 43.18,21.59 43.18,43.18
  pour Top (isolate 0.61): 43.18,43.18 43.18,21.59 76.2,21.59 72.39,43.18
V+WAS
  Top 0.813: C23.+ R19.2 | 90.17,95.25 132.08,95.25
  Top 1.016: 132.08,95.25 W.A.S..4
  Top 1.27: C23.+ 82.99,79.18 arc-45 85,80.01 90.17,80.01 90.17,95.25
  Top 1.676: IC2.OUT 67.31,64.77
  Top 2.184: 67.31,64.77 77.47,73.66 C23.+

### Text on the board
tPlace: Gnd | W.A.S. | Pwm2 | Pwm1 | +5v | Dir1 | High | Low | Gnd | Aux1 | Aux2 | Gnd | SDA | SCL | Reset | A0 | A1 | A2 | D2 | D5 | Out | On-Off | 12v | Gnd | BRN | BLK | BLU | BRN | BLK | BLU | BRN | BLK | BLU | Gnd | +12v Battery In | Gnd | +12 O C | +12 O C | +12 O C
tNames: 85 | 86